# Altium schematic sheet ShinStrap_Interface.SchDoc
size A3; Organization: Altium Limited; Address1: L3, 12a Rodborough Rd; Address2: Frenchs Forest; Address3: NSW; Address4: Australia 2086; DocumentNumber: 7; SheetNumber: 7; SheetTotal: 8
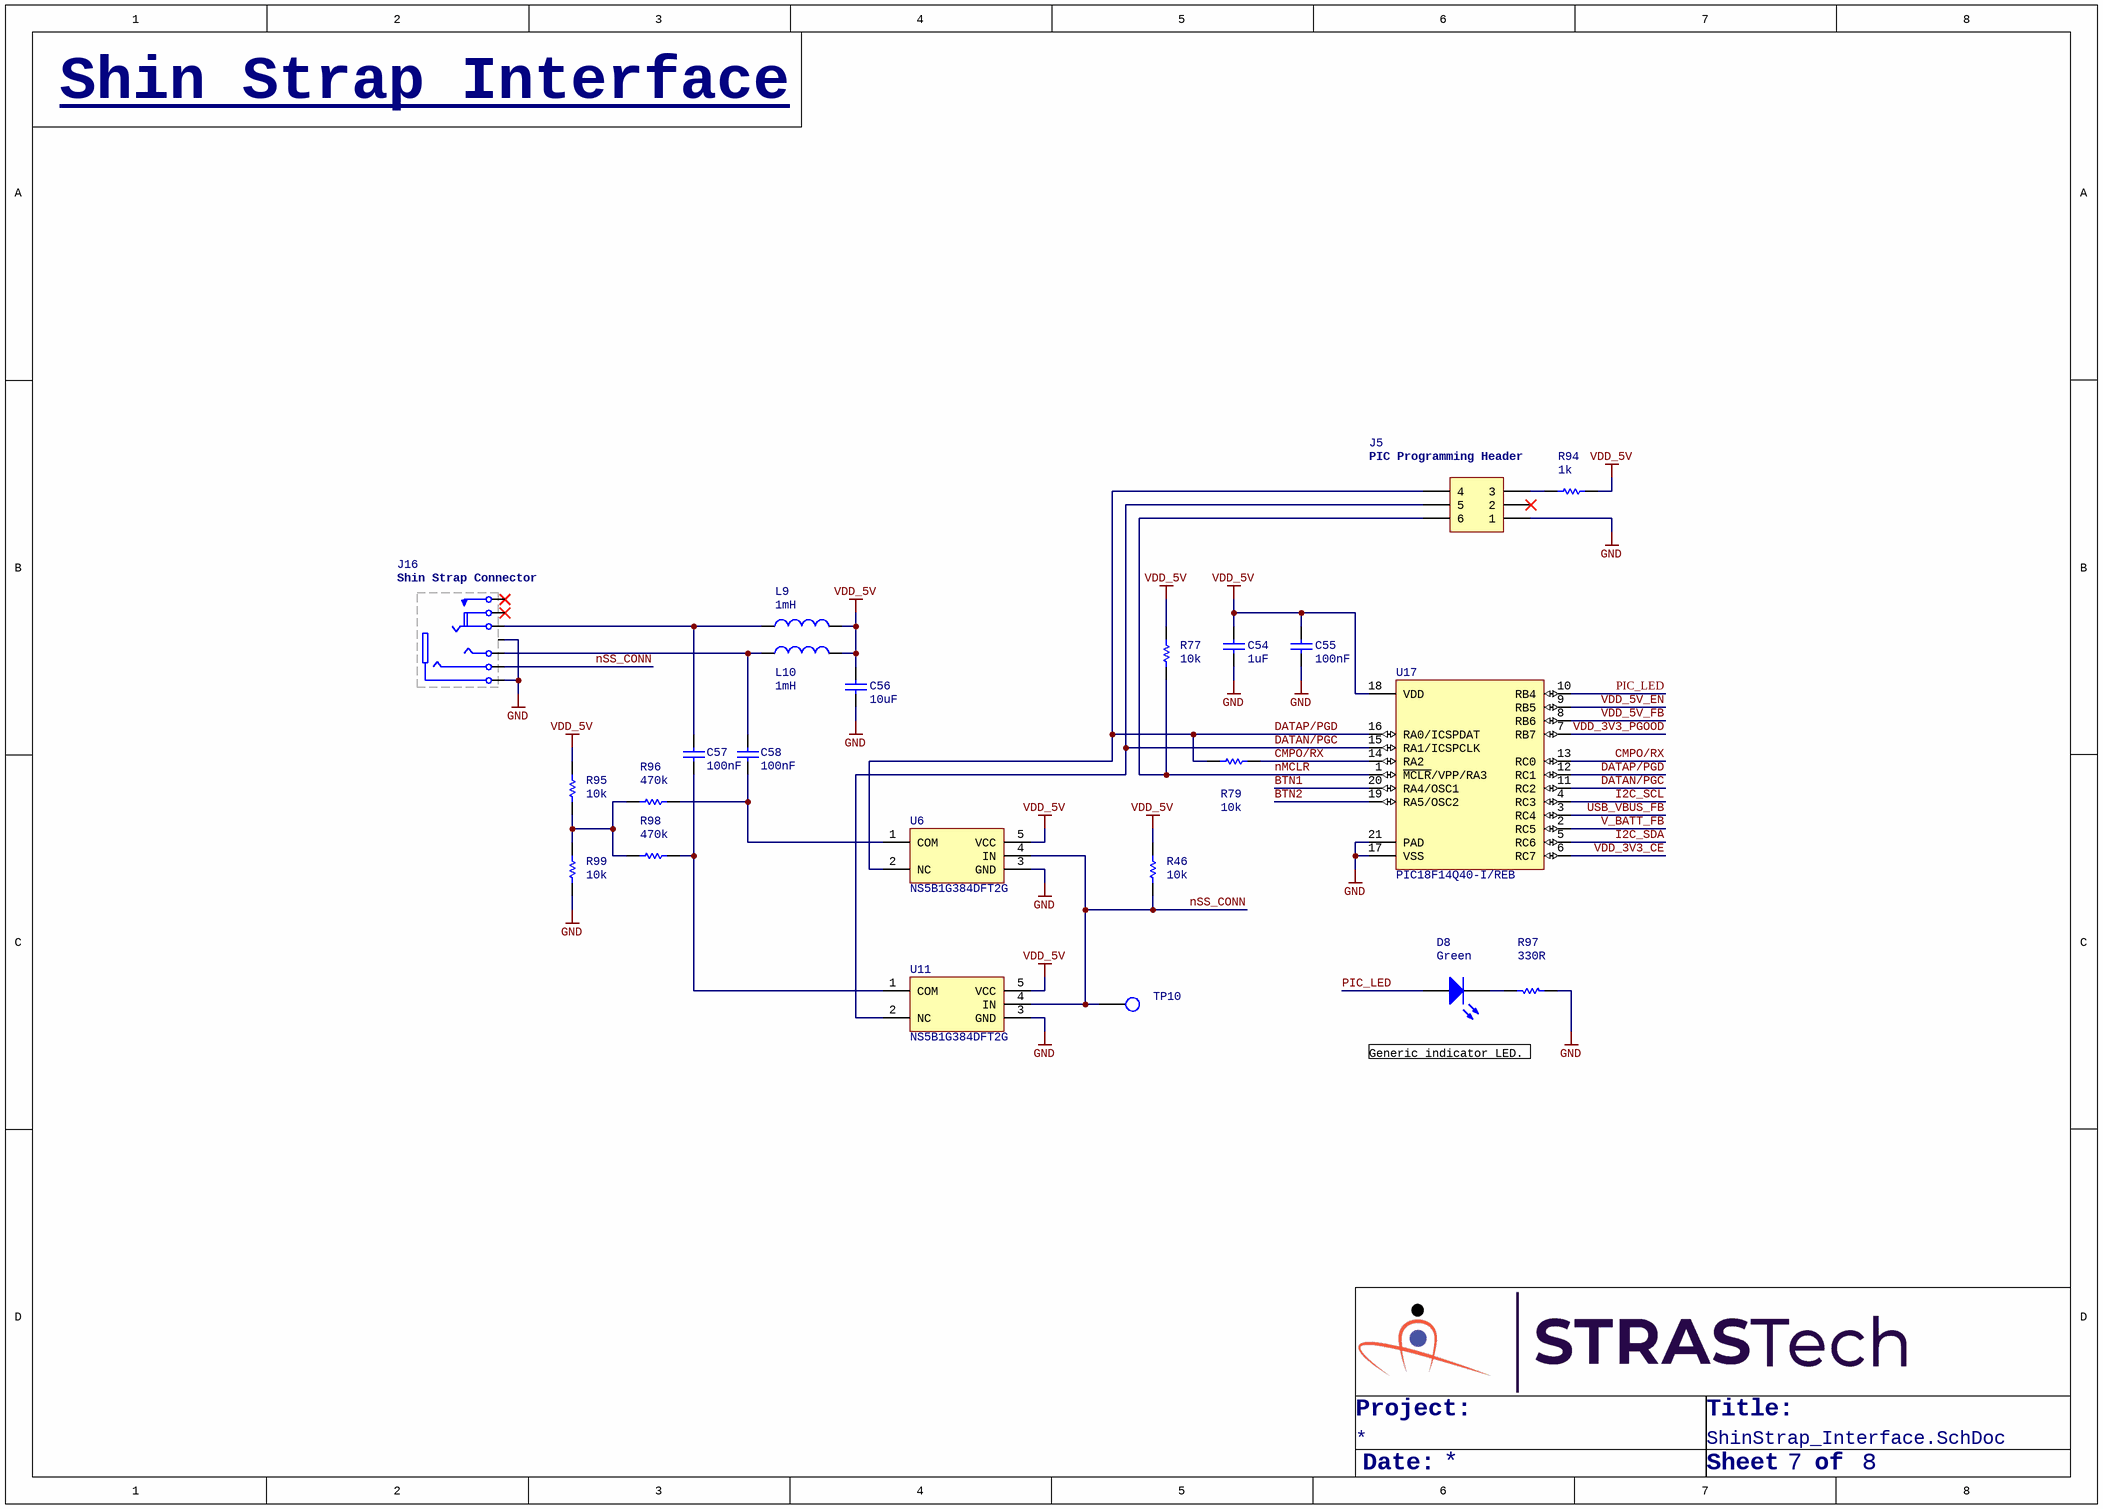
[diagram p0: ShinStrap_Interface.SchDoc]

## Parts
C54  1uF  [Cap,SMD,0402]
C55  100nF  [Cap,SMD,0402]
C56  10uF  [Cap,SMD,0402]
C57  100nF  [Cap,SMD,0402]
C58  100nF  [Cap,SMD,0402]
D8  Green  [LED,0603]
J5  Term,Header,3x2 Pin,1.27mm,SMD  [TERM,HEADER,3X2PIN,P1.27,SMD]  (value not drawn)
J16  Conn,Jack,TRS,3.5mm,Thru,Shielded  [Conn,Jack,TRS,3.5mm,Thru,Shielded]  (value not drawn)
L9  1mH  [IND,1210]
L10  1mH  [IND,1210]
R46  10k  [RES,0402]
R77  10k  [RES,0402]
R79  10k  [RES,0402]
R94  1k  [RES,0402]
R95  10k  [RES,0402]
R96  470k  [RES,0402]
R97  330R  [RES,0402]
R98  470k  [RES,0402]
R99  10k  [RES,0402]
TP10  TESTPOINT  [testpoint,smd,round,1mm]  (value not drawn)
U6  NS5B1G384DFT2G  [SC70-5]
U11  NS5B1G384DFT2G  [SC70-5]
U17  PIC18F14Q40-I/REB  [IC,QFN-20,3x3,PAD,P0.4]

## Nets
GND: C54.1 C55.1 C56.1 J5.1 J16.0(SH) J16.1(S) R97.1 R99.1 U6.3(GND) U11.3(GND) U17.17(VSS) U17.21(PAD)
VDD_5V: C54.2 C55.2 C56.2 L9.2 L10.2 R46.2 R77.2 R94.2 R95.2 U6.5(VCC) U11.5(VCC) U17.18(VDD)
BTN1: U17.20(RA4/OSC1)
BTN2: U17.19(RA5/OSC2)
CMPO/RX: R79.1 U17.13(RC0) U17.14(RA2)
DATAN/PGC: J5.5 U11.2(NC) U17.11(RC2) U17.15(RA1/ICSPCLK)
DATAP/PGD: J5.4 R79.2 U6.2(NC) U17.12(RC1) U17.16(RA0/ICSPDAT)
I2C_SCL: U17.4(RC3)
I2C_SDA: U17.5(RC6)
nMCLR: J5.6 R77.1 U17.1(~{MCLR}/VPP/RA3)
nSS_CONN: J16.4(R2) R46.1 TP10.1(TP) U6.4(IN) U11.4(IN)
PIC_LED: D8.1(A) U17.10(RB4)
USB_VBUS_FB: U17.3(RC4)
V_BATT_FB: U17.2(RC5)
VDD_3V3_CE: U17.6(RC7)
VDD_3V3_PGOOD: U17.7(RB7)
VDD_5V_EN: U17.9(RB5)
VDD_5V_FB: U17.8(RB6)
NetC57_1: C57.1 R98.1 U11.1(COM)
NetC57_2: C57.2 J16.3(R1) L9.1
NetC58_1: C58.1 R96.1 U6.1(COM)
NetC58_2: C58.2 J16.2(T) L10.1
NetD8_2: D8.2(K) R97.2
NetJ5_3: J5.3 R94.1
NetR95_1: R95.1 R96.2 R98.2 R99.2

Not connected (* = marked no-connect by the designer): J5 2*; J16 5(IR1)* 6(R1S)*

## Notes on the sheet
- Shin Strap Interface
- (near J5) PIC Programming Header
- (near J16) Shin Strap Connector
- Generic indicator LED.
- Project:
- Title:
- Date:
- Sheet
- of
- Title
- Size:
- A3
- Revision:
- Design By:

## Library data of the parts
C54 = CAP,Cer,1uF,35VDC,X5R,0402: 1 µF ±10% 35V Ceramic Capacitor X5R 0402 (1005 Metric); Vendor Part Number: 445-9073-1-ND; Manufacturer: TDK Corporation; Manufacturer Part Number: C1005X5R1V105K050BC; Vendor: Digikey; HelpURL: https://product.tdk.com/info/en/catalog/datasheets/mlcc_commercial_general_en.pdf?ref_disty=digikey; CreatedBy: Judd Foster
C55 C57 C58 = CAP,Cer,100nF,25VDC,X7R,0402: 0.1µF ±10% 25V Ceramic Capacitor X7R 0402 (1005 Metric); Vendor Part Number: 490-14603-1-ND; Manufacturer: Murata Electronics; Manufacturer Part Number: GRM155R71E104KE14J; Vendor: Digikey; HelpURL: https://search.murata.co.jp/Ceramy/image/img/A01X/G101/ENG/GRM155R71E104KE14-01.pdf; CreatedBy: Judd Foster
C56 = CAP,Cer,10uF,10VDC,X5R,0402: 10 µF ±20% 10V Ceramic Capacitor X5R 0402 (1005 Metric); Vendor Part Number: 1276-1450-1-ND; Manufacturer: Samsung Electro-Mechanics; Manufacturer Part Number: CL05A106MP5NUNC; Vendor: Digikey; HelpURL: https://media.digikey.com/pdf/Data%20Sheets/Samsung%20PDFs/CL05A106MP5NUNC_Spec.pdf; CreatedBy: Judd Foster
D8 = LED,Green,SMD,0603: Green 530nm LED Indication - Discrete 3V 0603 (1608 Metric); Manufacturer: Stanley Electric Co; Manufacturer Part Number: THG1111C-0005-TR; Vendor Part Number: 404-1286-1-ND; Vendor: Digikey; CreatedBy: Judd Foster; HelpURL: http://www.stanley-components.com/php/downloaddatafile.php?rp=0,THG1111C-0005_e.pdf
J5 = Term,Header,3x2 Pin,1.27mm,SMD: Connector Header Surface Mount 6 position 0.050" (1.27mm); Vendor Part Number: 609-3693-1-ND; Manufacturer: Amphenol ICC (FCI); Manufacturer Part Number: 20021121-00006C4LF; Vendor: Digikey; HelpURL: https://media.digikey.com/pdf/Data%20Sheets/FCI%20PDFs/Minitek%20127_Catalog.pdf; CreatedBy: Judd Foster
J16 = Conn,Jack,TRS,3.5mm,Thru,Shielded: 3.50mm (0.141", 1/8", Mini Plug) - Headphone Phone Jack Stereo (4 Conductor, TRRS) Connector Solder; Manufacturer: CUI Devices; Manufacturer Part Number: SJ-435107RS; Vendor Part Number: CP-435107RS-ND; Vendor: Digikey; CreatedBy: Judd Foster; HelpURL: https://www.cuidevices.com/product/resource/digikeypdf/sj-435107.pdf
L9 L10 = IND,1mH,100mA,Wirewound,1210: 1 mH Unshielded Wirewound Inductor 100 mA 16.9Ohm Max 1210 (3225 Metric); Vendor Part Number: 587-CBC3225T102MRCT-ND; Manufacturer: Taiyo Yuden; Manufacturer Part Number: CBC3225T102MR; Vendor: Digikey; HelpURL: https://ds.yuden.co.jp/TYCOMPAS/ut/detail?pn=CBC3225T102MR%20&u=M; CreatedBy: Judd Foster
R46 R77 R79 R95 R99 = RES,10k,5%,0.063W,0402: 10 kOhms ±5% 0.063W, 1/16W Chip Resistor 0402 (1005 Metric) Automotive AEC-Q200 Thick Film; Vendor Part Number: RMCF0402JT10K0CT-ND; Manufacturer: Stackpole Electronics Inc; Manufacturer Part Number: RMCF0402JT10K0; Vendor: DIgikey; HelpURL: https://www.seielect.com/catalog/sei-rmcf_rmcp.pdf; CreatedBy: Judd Foster
R94 = RES,1k,5%,0.063W,0402: 1 kOhms ±5% 0.063W, 1/16W Chip Resistor 0402 (1005 Metric) Automotive AEC-Q200 Thick Film; Vendor Part Number: RMCF0402JT1K00CT-ND; Manufacturer: Stackpole Electronics Inc; Manufacturer Part Number: RMCF0402JT1K00; Vendor: DIgikey; HelpURL: https://www.seielect.com/catalog/sei-rmcf_rmcp.pdf; CreatedBy: Judd Foster
R96 R98 = RES,470k,5%,0.063W,0402: 470 kOhms ±5% 0.063W, 1/16W Chip Resistor 0402 (1005 Metric) Automotive AEC-Q200 Thick Film; Manufacturer: Stackpole Electronics Inc; Manufacturer Part Number: RMCF0402JT470K; Vendor Part Number: RMCF0402JT470KCT-ND; Vendor: Digikey; CreatedBy: Judd Foster; HelpURL: https://www.seielect.com/catalog/sei-rmcf_rmcp.pdf
R97 = RES,330R,5%,0.063W,0402: 330 Ohms ±5% 0.063W, 1/16W Chip Resistor 0402 (1005 Metric) Automotive AEC-Q200 Thick Film; Manufacturer: Stackpole Electronics Inc; Manufacturer Part Number: RMCF0402JT330R; Vendor Part Number: RMCF0402JT330RCT-ND; Vendor: Digikey; CreatedBy: Judd Foster; HelpURL: https://www.seielect.com/catalog/sei-rmcf_rmcp.pdf
TP10 = TESTPOINT: PCB Testpoint; CreatedBy: Judd Foster; HelpURL: N/A; Manufacturer: N/A; Manufacturer Part Number: N/A; Vendor: N/A; Vendor Part Number: N/A
U6 U11 = NS5B1G384DFT2G: 1 Circuit IC Switch 1:1 15Ohm SC-88A (SC-70-5/SOT-353); Manufacturer: onsemi; Vendor Part Number: NS5B1G384DFT2GOSCT-ND; Vendor: Digikey; CreatedBy: Judd Foster; HelpURL: https://www.onsemi.com/pdf/datasheet/ns5b1g384-d.pdf; Manufacturer Part Number: NS5B1G384DFT2G
U17 = PIC18F14Q40-I/REB: PIC series Microcontroller IC 8-Bit 64MHz 16KB (16K x 8) FLASH 20-VQFN (3x3); Manufacturer: Microchip Technology; Vendor Part Number: 150-PIC18F14Q40-I/REB-ND; Vendor: Digikey; CreatedBy: Judd Foster; HelpURL: https://ww1.microchip.com/downloads/en/DeviceDoc/PIC18F04-05-14-15-Q40-1420-Pin-Low-Power-High-Performance-Microcontroller-With-XLP-Technology-Data-Sheet-40002236B.pdf; Manufacturer Part Number: PIC18F14Q40-I/REB